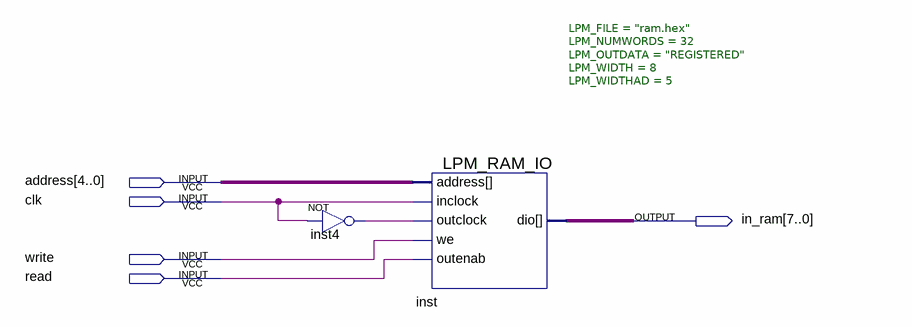
[diagram p0: schematic sheet]
// Quartus schematic ram.bdf as structural Verilog: 2 symbols, 5 pins
module ram (
  input  [4:0] address,
  input  clk,
  input  write,
  input  read,
  output [7:0] in_ram
);

  wire inst4_out;

  not inst4 (inst4_out, clk);
  LPM_RAM_IO #(.LPM_FILE("ram.hex"), .LPM_NUMWORDS(32), .LPM_OUTDATA("REGISTERED"), .LPM_WIDTH(8), .LPM_WIDTHAD(5)) inst (
    .address(address), .outclock(inst4_out), .inclock(clk), .we(write), .outenab(read), .dio(in_ram));
endmodule
